# EasyEDA Pro project 搞机小队_v1.1.3.eprj, board 光流
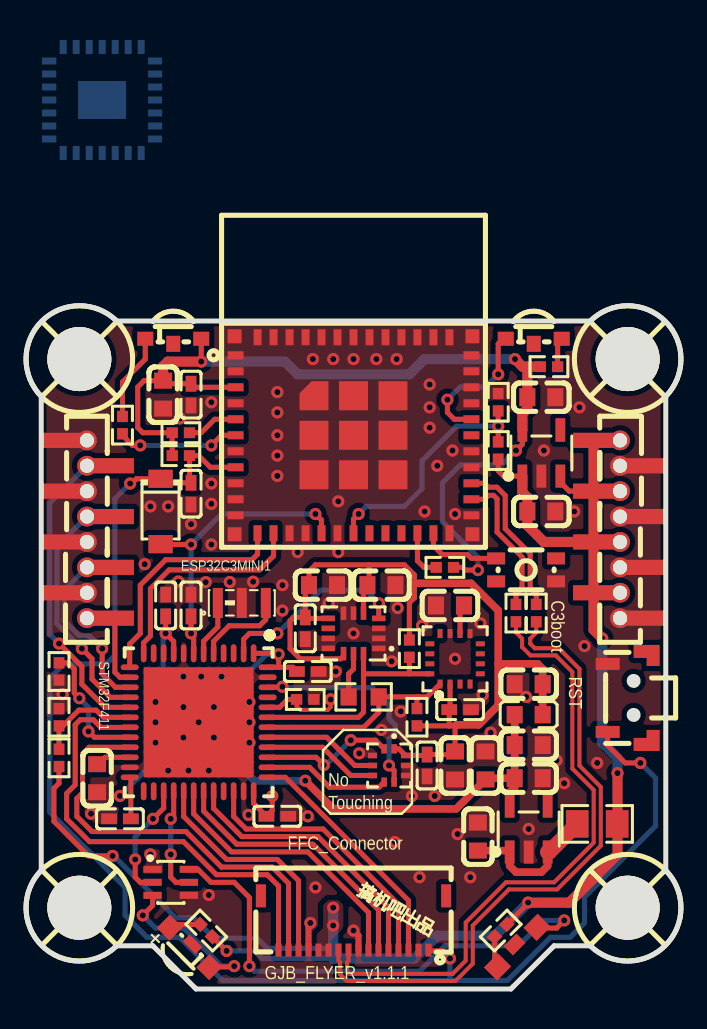
[diagram p4: board, top side]
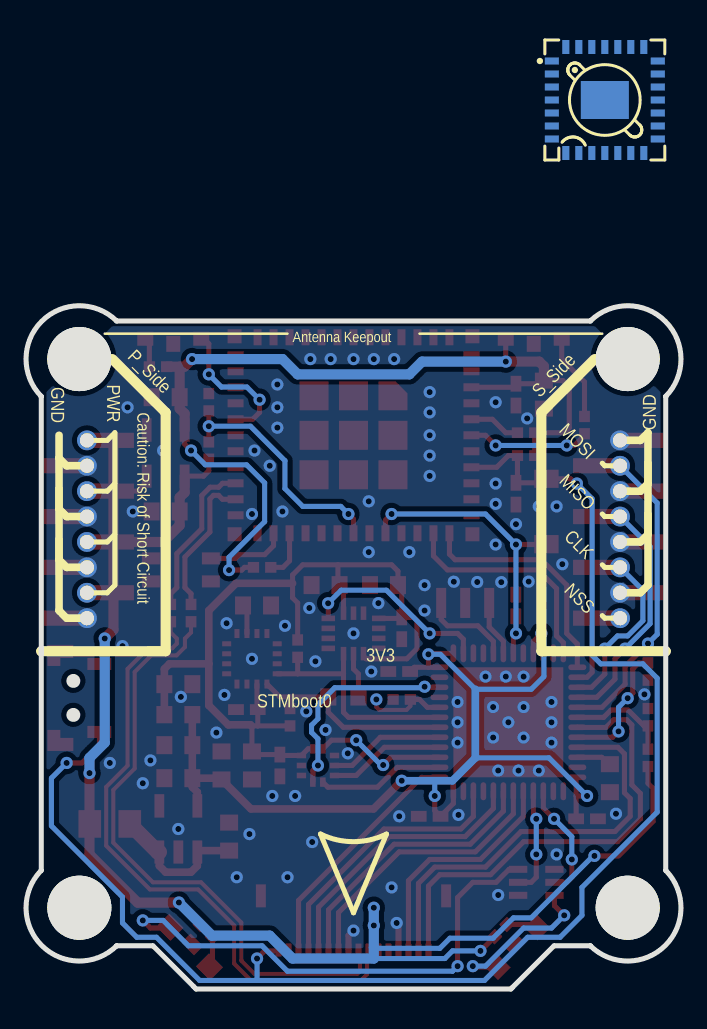
[diagram p5: board, bottom side, seen from below]

Outline 32.77 x 34.16 mm; copper layers: Top Layer, Bottom Layer. Coordinates in mm from the lower left corner of the outline.
Outline path: 0.76,29.64 0.77,29.63 0.77,5.93 0.76,5.92 arc(0.79,2.18) 4.53,2.15 4.54,2.16 6.35,2.16 8.51,0 24.26,0 26.42,2.16 28.24,2.16 28.24,2.15 arc(31.99,2.18) 32.01,5.92 32.01,5.93 32.01,29.63 32.01,29.64 arc(31.99,33.38) 28.24,33.41 28.24,33.4 4.54,33.4 4.53,33.41 arc(0.79,33.38) 0.76,29.64
Stack: Top Layer 0.035mm / Dielectric1 1.51mm FR4 er 4.5 / Bottom Layer 0.035mm

## Design rules (mm)
net $1N52615: DP5
net $1N52617: DP5
net UD3_N: DP4
net UD3_P: DP4
template: 自定义配置
spacing copperThickness1oz (default): track to track 0.102, other pairs 0.152 to 0.3
spacing copperThickness2oz: track to track 0.203, other pairs 0.152 to 0.3
track width copperThickness1oz (default): min 0.127, default 0.254, max 2.54
track width copperThickness2oz: min 0.203, default 0.254, max 2.54
differential pair differentialPair (default): width min 0.127, default 0.254, max 2.54; gap min 0.152, default 0.152
via viaSize (default): diameter min 0.5, default 0.61, max 10; hole min 0.3, default 0.305, max 6.3

## Placement (name value [footprint] x y rotation side)
C3  10uF  [C0603]  25.79 23.88 180 top
C4  1uF  [C0603]  25.79 29.59 180 top
C6  1uF  [C0603]  25.15 10.54 180 top
C7  1uF  [C0603]  22.61 7.62 270 top
C8  10uF  [C0603]  25.15 12.19 180 top
C9  10uF  [C0603]  25.15 15.24 0 top
C27  10uF  [C0603]  3.56 10.54 90 top
C31  10uF  [C0603]  22.99 11.18 270 top
C41  10uF  [C0603]  6.86 29.72 270 top
C51  4.7uF  [C0603]  21.47 11.18 270 top
C52  4.7uF  [C0603]  21.21 19.18 180 top
C55  2.2uF  [C0603]  14.86 20.19 180 top
C56  10nF  [C0603]  17.78 20.19 180 top
C65  100nF  [C0402]  4.7 8.51 0 top
C66  100nF  [C0402]  12.58 8.64 180 top
C67  100nF  [C0402]  14.1 15.88 180 top
C68  100nF  [C0402]  6.99 19.18 270 top
C69  100nF  [C0402]  8.26 19.18 270 top
C70  100nF  [C0402]  13.97 18.03 90 top
C71  100nF  [C0402]  21.72 13.97 180 top
C72  100nF  [C0402]  20.07 11.18 90 top
C73  100nF  [C0402]  8.26 24.77 90 top
C74  100nF  [C0402]  8.26 29.72 270 top
D7  B0520W  [SOD-123_L2.7-W1.6-LS3.7-RD]  6.74 23.88 270 top
FPC2  AFC05-S16FIA-00  [FPC-SMD_16P-P0.50_AFC05-S16FIA-00]  16.39 3.3 180 top
L1  1uH  [L0603]  25.15 13.72 0 top
LED2  XL-3210SURC  [LED-SMD_L3.2-W1.5_1204-1.5T_RED]  24.52 2.16 225 top
LED3  XL-3210UWC  [LED-SMD_3P-L3.2-W1.5-RD_ORANGE]  7.37 32.38 0 top
LED4  XL-3210UWC  [LED-SMD_3P-L3.2-W1.5-RD_ORANGE]  25.4 32.38 0 top
NOREF  -  [Pad_e1244]  3.05 23.62 0 top
NOREF#2  -  [Pad_e1266]  29.72 23.62 0 top
NOREF#3  -  [Pad_e1245]  3.05 22.35 0 top
NOREF#4  -  [Pad_e1268]  29.72 21.08 0 top
NOREF#5  -  [Pad_e1269]  29.72 19.81 0 top
NOREF#6  -  [Pad_e1246]  3.05 21.08 0 top
NOREF#7  -  [Pad_e1267]  29.72 22.35 0 top
NOREF#8  -  [Pad_e1242]  3.05 26.16 0 top
NOREF#9  -  [Pad_e1270]  29.72 18.54 0 top
NOREF#10  -  [Pad_e1264]  29.72 26.16 0 top
NOREF#11  -  [Pad_e1247]  3.05 19.81 0 top
NOREF#12  -  [Pad_e1243]  3.05 24.89 0 top
NOREF#13  -  [Pad_e1241]  3.05 27.43 0 top
NOREF#14  -  [Pad_e1248]  3.05 18.54 0 top
NOREF#15  -  [Pad_e1265]  29.72 24.89 0 top
NOREF#16  -  [Pad_e1263]  29.72 27.43 0 top
Q7  BSS138PS  [SOT-363_L2.1-W1.3-P0.65-LS2.3-BL]  7.24 5.33 270 top
R2  0Ω  [R0805]  28.58 8.25 180 top
R51  0Ω  [R0402]  24.52 18.8 90 top
R52  0Ω  [R0402]  25.53 18.8 90 top
R53  10kΩ  [R0402]  7.75 27.81 0 top
R54  10kΩ  [R0402]  20.96 21.08 180 top
R55  10kΩ  [R0402]  7.75 26.67 180 top
R56  10kΩ  [R0402]  1.66 15.88 270 top
R57  10kΩ  [R0402]  13.97 14.48 180 top
R71  10kΩ  [R0402]  1.66 11.56 270 top
R72  10kΩ  [R0402]  1.66 13.59 270 top
R73  10kΩ  [R0402]  23.63 26.92 270 top
R74  10kΩ  [R0402]  23.63 29.34 270 top
R80  4.7kΩ  [R0402]  19.18 17.02 270 top
R81  4.7kΩ  [R0402]  19.56 13.59 90 top
R100  10kΩ  [R0402]  9.02 2.92 315 top
R101  10kΩ  [R0402]  23.75 2.92 45 top
R102  10kΩ  [R0402]  4.83 28.19 90 top
R103  10kΩ  [R0402]  26.17 31.11 180 top
R104  0Ω  [R0603]  16.9 14.6 0 top
SCREW5  -  [M3螺丝]  2.67 31.5 0 top
SCREW6  -  [M3螺丝]  2.67 4.06 0 top
SCREW7  -  [M3螺丝]  30.1 31.5 0 top
SCREW8  -  [M3螺丝]  30.1 4.06 0 top
SW3  TS24CA  [SW-SMD_2P-TS24CA]  30.08 14.55 270 top
SW4  1TS028A-1800-0600-CT  [SW-SMD_4P-L2.8-W1.9-P1.20-LS3.0_1TS028A]  25.02 20.95 0 top
U2  XC6204B302MR  [SOT-23-5_L3.0-W1.7-P0.95-LS2.8-BL]  25.79 26.8 0 top
U3  XC6204B302MR  [SOT-23-5_L3.0-W1.7-P0.95-LS2.8-BL]  25.15 8 0 top
U9  STM32F411CEU6  [UFQFPN-48_L7.0-W7.0-P0.50-BL-EP]  8.64 13.33 180 top
U10  2.4GHz  [WIFIM-SMD_ESP32-C3-MINI-1]  16.39 27.69 0 top
U15  LPS22HBTR  [HLGA-10L_LPS22HBTR]  18.17 11.18 270 top
U16  QMC5883P  [LGA-16_L3.0-W3.0-P0.50-BL_SQ]  21.47 16.51 0 top
U17  ICM-42688-P  [LGA-14_L3.0-W2.5-P0.50-TL]  16.39 17.78 180 top
U20  XL-3210UGC  [LED-SMD_3P-L3.2-W1.5-RD_GREEN]  8.26 2.16 135 top
U21  IPCP127F08PB08S  [HDR-SMD_IPCP127F08PB08S]  3.05 22.99 270 top
U22  IPCP127F08PB08S  [HDR-SMD_IPCP127F08PB08S]  29.72 22.99 90 top
U23  PMW3901MB-TXQT  [COB-28_L6.0-W6.0-P0.65-TL-EP]  3.81 44.45 180 bottom
X2  8MHz  [OSC-SMD_3P-L3.2-W1.3-P1.20]  10.8 19.3 0 top

## Footprints (pads in the part's own frame, mm; a bottom-side part is the same pattern mirrored in y, then rotated)
C0402
  rect 0.79x0.54 smd: 1(-0.545,0) 2(0.545,0)
C0603
  rect 0.8x0.9 smd: 1(-0.7,0) 2(0.7,0)
COB-28_L6.0-W6.0-P0.65-TL-EP
  rect 0.7x0.35 smd: 1(-2.65,1.95) 2(-2.65,1.3) 3(-2.65,0.65) 4(-2.65,0) 5(-2.65,-0.65) 6(-2.65,-1.3) 7(-2.65,-1.95) 15(2.65,-1.95) 16(2.65,-1.3) 17(2.65,-0.65) 18(2.65,0) 19(2.65,0.65) 20(2.65,1.3) 21(2.65,1.95)
  rect 0.35x0.7 smd: 8(-1.95,-2.65) 9(-1.3,-2.65) 10(-0.65,-2.65) 11(0,-2.65) 12(0.65,-2.65) 13(1.3,-2.65) 14(1.95,-2.65) 22(1.95,2.65) 23(1.3,2.65) 24(0.65,2.65) 25(0,2.65) 26(-0.65,2.65) 27(-1.3,2.65) 28(-1.95,2.65)
  rect 2.4x1.9 smd: 29(0,0)
FPC-SMD_16P-P0.50_AFC05-S16FIA-00
  rect 0.3x0.65 smd: 1(-3.75,1.355) 2(-3.25,1.355) 3(-2.75,1.355) 4(-2.25,1.355) 5(-1.75,1.355) 6(-1.25,1.355) 7(-0.75,1.355) 8(-0.25,1.355) 9(0.25,1.355) 10(0.75,1.355) 11(1.25,1.355) 12(1.75,1.355) 13(2.25,1.355) 14(2.75,1.355) 15(3.25,1.355) 16(3.75,1.355)
  rect 0.5x1.15 smd: 17(4.635,-1.355) 18(-4.635,-1.355)
HDR-SMD_IPCP127F08PB08S
  rect 0.76x2.05 smd: 1(-4.445,-1.325) 2(-3.175,1.325) 3(-1.905,-1.325) 4(-0.635,1.325) 5(0.635,-1.325) 6(1.905,1.325) 7(3.175,-1.325) 8(4.445,1.325)
HLGA-10L_LPS22HBTR
  rect 0.465x0.28 smd: 1(-0.833,0.255) 2(-0.833,-0.245) 6(0.833,-0.245) 7(0.833,0.255)
  rect 0.28x0.465 smd: 3(-0.5,-0.828) 4(0,-0.828) 5(0.5,-0.828) 8(0.5,0.828) 9(0,0.828) 10(-0.5,0.828)
L0603
  rect 0.8x0.864 smd: 1(-0.7,0) 2(0.7,0)
LED-SMD_3P-L3.2-W1.5-RD_GREEN
  rect 0.9x0.93 smd: 1(-1.4,0.11) 2(1.4,0.11)
  rect 0.9x0.49 smd: 3(0,-0.11)
LED-SMD_3P-L3.2-W1.5-RD_ORANGE
  rect 0.8x0.7 smd: 1(-1.4,0.127) 2(1.4,0.127)
  rect 0.7x0.8 smd: 3(0,-0.127)
LED-SMD_L3.2-W1.5_1204-1.5T_RED
  rect 1x0.93 smd: 1(-1.4,0.095) 2(1.4,0.095)
  rect 0.9x0.65 smd: 3(0,-0.095)
LGA-14_L3.0-W2.5-P0.50-TL
  rect 0.675x0.28 smd: 1(-1.262,0.75) 2(-1.262,0.25) 3(-1.262,-0.25) 4(-1.262,-0.75) 8(1.262,-0.75) 9(1.262,-0.25) 10(1.262,0.25) 11(1.262,0.75)
  rect 0.28x0.675 smd: 5(-0.5,-1.012) 6(0,-1.012) 7(0.5,-1.012) 12(0.5,1.012) 13(0,1.012) 14(-0.5,1.012)
LGA-16_L3.0-W3.0-P0.50-BL_SQ
  rect 0.25x0.45 smd: 1(-0.75,-1.263) 2(-0.25,-1.263) 3(0.25,-1.263) 4(0.75,-1.263) 9(0.75,1.263) 10(0.25,1.263) 11(-0.25,1.263) 12(-0.75,1.263)
  rect 0.45x0.25 smd: 5(1.263,-0.75) 6(1.263,-0.25) 7(1.263,0.25) 8(1.263,0.75) 13(-1.263,0.75) 14(-1.263,0.25) 15(-1.263,-0.25) 16(-1.263,-0.75)
M3螺丝
  round 3.2 hole 3.2: 1(0,0)
OSC-SMD_3P-L3.2-W1.3-P1.20
  rect 0.5x1.5 smd: 1(-1.2,0) 2(0,0) 3(1.2,0)
Pad_e1241
  round 0.991 hole 0.711: 1(0,0)
Pad_e1242
  round 0.991 hole 0.711: 2(0,0)
Pad_e1243
  round 0.991 hole 0.711: 3(0,0)
Pad_e1244
  round 0.991 hole 0.711: 4(0,0)
Pad_e1245
  round 0.991 hole 0.711: 5(0,0)
Pad_e1246
  round 0.991 hole 0.711: 6(0,0)
Pad_e1247
  round 0.991 hole 0.711: 7(0,0)
Pad_e1248
  round 0.991 hole 0.711: 8(0,0)
Pad_e1263
  round 0.991 hole 0.711: 1(0,0)
Pad_e1264
  round 0.991 hole 0.711: 2(0,0)
Pad_e1265
  round 0.991 hole 0.711: 3(0,0)
Pad_e1266
  round 0.991 hole 0.711: 4(0,0)
Pad_e1267
  round 0.991 hole 0.711: 5(0,0)
Pad_e1268
  round 0.991 hole 0.711: 6(0,0)
Pad_e1269
  round 0.991 hole 0.711: 7(0,0)
Pad_e1270
  round 0.991 hole 0.711: 8(0,0)
R0402
  rect 0.566x0.54 smd: 1(-0.433,0) 2(0.433,0)
R0603
  rect 0.806x0.864 smd: 1(-0.753,0) 2(0.753,0)
R0805
  rect 1.133x1.377 smd: 1(-1,0) 2(1,0)
SOD-123_L2.7-W1.6-LS3.7-RD
  rect 0.91x1.22 smd: 1(-1.635,0) 2(1.635,0)
SOT-23-5_L3.0-W1.7-P0.95-LS2.8-BL
  rect 0.49x1.157 smd: 1(-0.95,-1.153) 2(0,-1.153) 3(0.95,-1.153)
  rect 0.49x1.175 smd: 4(0.95,1.153) 5(-0.95,1.153)
SOT-363_L2.1-W1.3-P0.65-LS2.3-BL
  rect 0.35x0.916 smd: 1(-0.65,-0.908) 2(0,-0.908) 3(0.65,-0.908) 4(0.65,0.908) 5(0,0.908) 6(-0.65,0.908)
SW-SMD_2P-TS24CA
  rect 0.6x1.2 smd: 1(-1.7,-0.975) 2(1.7,-0.975)
  custom 1.05x1.3 smd: 3(2.125,0.975) 4(-2.125,0.975)
SW-SMD_4P-L2.8-W1.9-P1.20-LS3.0_1TS028A
  rect 0.9x0.6 smd: 1(-1.5,0.575) 2(-1.5,-0.575) 3(1.5,0.575) 4(1.5,-0.575)
UFQFPN-48_L7.0-W7.0-P0.50-BL-EP
  oval 0.28x0.9 smd: 1(-2.751,-3.45) 2(-2.251,-3.45) 3(-1.75,-3.45) 4(-1.25,-3.45) 5(-0.749,-3.45) 6(-0.249,-3.45) 7(0.249,-3.45) 8(0.75,-3.45) 9(1.25,-3.45) 10(1.75,-3.45) 11(2.251,-3.45) 12(2.751,-3.45) 25(2.751,3.449) 26(2.251,3.449) 27(1.75,3.449) 28(1.25,3.449) 29(0.75,3.449) 30(0.249,3.449) 31(-0.249,3.449) 32(-0.749,3.449) 33(-1.25,3.449) 34(-1.75,3.449) 35(-2.251,3.449) 36(-2.751,3.449)
  oval 0.9x0.28 smd: 13(3.45,-2.751) 14(3.45,-2.251) 15(3.45,-1.75) 16(3.45,-1.25) 17(3.45,-0.75) 18(3.45,-0.249) 19(3.45,0.249) 20(3.45,0.749) 21(3.45,1.25) 22(3.45,1.75) 23(3.45,2.251) 24(3.45,2.751) 37(-3.449,2.751) 38(-3.449,2.251) 39(-3.449,1.75) 40(-3.449,1.25) 41(-3.449,0.749) 42(-3.449,0.249) 43(-3.449,-0.249) 44(-3.449,-0.75) 45(-3.449,-1.25) 46(-3.449,-1.75) 47(-3.449,-2.251) 48(-3.449,-2.751)
  rect 5.5x5.5 smd: 49(0,0)
WIFIM-SMD_ESP32-C3-MINI-1
  rect 0.8x0.4 smd: 1(-5.9,4) 2(-5.9,3.2) 3(-5.9,2.4) 4(-5.9,1.6) 5(-5.9,0.8) 6(-5.9,0) 7(-5.9,-0.8) 8(-5.9,-1.6) 9(-5.9,-2.4) 10(-5.9,-3.2) 11(-5.9,-4) 25(5.9,-4) 26(5.9,-3.2) 27(5.9,-2.4) 28(5.9,-1.6) 29(5.9,-0.8) 30(5.9,0) 31(5.9,0.8) 32(5.9,1.6) 33(5.9,2.4) 34(5.9,3.2) 35(5.9,4)
  rect 0.4x0.8 smd: 12(-4.8,-4.9) 13(-4,-4.9) 14(-3.2,-4.9) 15(-2.4,-4.9) 16(-1.6,-4.9) 17(-0.8,-4.9) 18(0,-4.9) 19(0.8,-4.9) 20(1.6,-4.9) 21(2.4,-4.9) 22(3.2,-4.9) 23(4,-4.9) 24(4.8,-4.9) 36(4.8,4.9) 37(4,4.9) 38(3.2,4.9) 39(2.4,4.9) 40(1.6,4.9) 41(0.8,4.9) 42(0,4.9) 43(-0.8,4.9) 44(-1.6,4.9) 45(-2.4,4.9) 46(-3.2,4.9) 47(-4,4.9) 48(-4.8,4.9)
  custom 1.45x1.45 smd: 49(-1.975,1.975)
  rect 1.45x1.45 smd: 49(-1.975,0) 49(-1.975,-1.975) 49(0,1.975) 49(0,0) 49(0,-1.975) 49(1.975,1.975) 49(1.975,0) 49(1.975,-1.975)
  rect 0.7x0.7 smd: 50(5.95,4.95) 51(5.95,-4.95) 52(-5.95,-4.95) 53(-5.95,4.95)

## Nets
3V3_D: C6.2 C8.2 C31.2 C65.2 C66.2 C67.2 C68.2 L1.1 U3.5 U9.1 U9.9 U9.24 U9.36 U9.48
3V3_IMU: C9.2 C51.1 C55.2 C56.2 C70.2 C71.2 C72.2 L1.2 R80.1 R81.1 U15.1 U15.10 U16.2 U17.5 U17.8 U17.12
3V3_RF: C4.2 C41.1 C74.1 LED3.2 R53.1 R54.1 R55.2 R103.2 U2.5 U10.3
GND: C3.1 C4.1 C6.1 C7.1 C8.1 C9.1 C27.1 C31.1 C41.2 C51.2 C52.2 C55.1 C56.1 C65.1 C66.1 C67.1 C68.1 C69.1 C70.1 C71.1 C72.1 C73.1 C74.2 FPC2.2 FPC2.8 FPC2.13 NOREF#2.4 NOREF#3.5 NOREF#4.6 NOREF#9.8 NOREF#10.2 NOREF#11.7 NOREF#12.3 NOREF#13.1 Q7.1 Q7.4 R56.2 R57.1 R72.1 R74.1 SW3.1 SW4.4 U2.2 U3.2 U9.8 U9.23 U9.35 U9.47 U9.49 U10.1 U10.2 U10.4 U10.7 U10.9 U10.10 U10.11 U10.14 U10.15 U10.17 U10.24 U10.25 U10.28 U10.29 U10.32 U10.33 U10.34 U10.35 U10.36 U10.37 U10.38 U10.39 U10.40 U10.41 U10.42 U10.43 U10.44 U10.45 U10.46 U10.47 U10.48 U10.49 U10.50 U10.51 U10.52 U10.53 U15.3 U15.8 U15.9 U16.9 U16.11 U17.1 U17.2 U17.3 U17.6 U17.7 U17.10 U17.11 U21.1 U21.3 U21.5 U21.7 U22.1 U22.3 U22.5 U22.7 U23.1 U23.21 U23.29 X2.2
BARO_INT: U9.46 U15.7
BOOT_IO9: SW4.1 U10.23
ESP_V_SENSE: R73.1 R74.2 U10.18
IMU_INT1: U9.2 U17.4
LED_G: Q7.3 U20.1
LED_G#: Q7.5 U9.28
LED_R: LED2.1 Q7.6
LED_R#: Q7.2 U9.27
LED_WL: R102.1 U10.6
LED_WR: LED4.1 U10.31
MOTOR1: FPC2.14 U9.29
MOTOR2: FPC2.15 U9.21
MOTOR3: FPC2.16 U9.19
MOTOR4: FPC2.5 U9.32
NRST: C73.2 D7.1 FPC2.1 R55.1 SW3.2 U10.8
POWER: C3.2 FPC2.11 FPC2.12 NOREF#5.7 NOREF#7.5 NOREF#15.3 NOREF#16.1 R2.1 R71.2 R73.2 R100.2 R101.2 U2.1 U2.3 U22.2 U22.4 U22.6 U22.8
STM_BOOT0: R57.2 U9.44
STM_NRST: C69.2 D7.2 U9.7 U10.16
STM_RXD1: FPC2.6 U9.31
STM_RXD2: U9.13 U10.12
STM_SPI_CLK1: NOREF#6.6 U9.15 U21.6
STM_SPI_CLK3: U9.39 U15.2
STM_SPI_MISO1: NOREF.4 U9.16 U21.4
STM_SPI_MISO3: U9.40 U15.5
STM_SPI_MOSI1: NOREF#8.2 U9.17 U21.2
STM_SPI_MOSI3: U9.41 U15.4
STM_SPI_NSS1: NOREF#14.8 U9.14 U21.8
STM_SPI_NSS3: U9.38 U15.6
STM_SWCLK: FPC2.3 U9.37
STM_SWDIO: FPC2.4 U9.34
STM_TXD1: FPC2.7 U9.30
STM_TXD2: U9.12 U10.13
STM_V_SENSE: R71.1 R72.2 U9.18
STMI2C_SCL1: R81.2 R104.2 U9.42 U16.1
STMI2C_SDA1: R80.2 U9.43 U16.16 U17.14
UD3_N: FPC2.9 R51.1
UD3_P: FPC2.10 R52.1
$1N7736: C7.2 R2.2 U3.1 U3.3
$1N7770: C27.2 U9.22
$1N7798: U9.5 X2.3
$1N7799: U9.6 X2.1
$1N7801: R56.1 U9.20
$1N11574: R53.2 U10.5
$1N11654: R54.2 U10.22
$1N15598: C52.1 U16.10
$1N42229: R104.1 U17.13
$1N52615: R51.2 U10.26
$1N52617: R52.2 U10.27
$1N93489: R100.1 U20.2
$1N93528: LED2.2 R101.1
$1N93606: LED4.2 R103.1
$1N93656: LED3.1 R102.2

Pads without a net: FPC2 17 18; LED2 3; LED3 3; LED4 3; SCREW5 1; SCREW6 1; SCREW7 1; SCREW8 1; SW3 3 4; SW4 2 3; U2 4; U3 4; U9 3 4 10 11 25 26 33 45; U10 19 20 21 30; U16 3 4 5 6 7 8 12 13 14 15; U17 9; U20 3; U23 2 3 4 5 6 7 8 9 10 11 12 13 14 15 16 17 18 19 20 22 23 24 25 26 27 28

## Via types
v1: diameter 0.61, hole 0.305, Top Layer to Bottom Layer, 137 vias

## Routing (per net, layer and track width the routed paths; a pad name or vN(x,y) marks a point on that pad's centre or on a via; arc(x,y) is an arc through that point)
3V3_D: length 50.8
  Top Layer w0.254: U9.24 5.25,10.53 5.25,9.65 ; v1(12.32,9.65) 12.32,8.93 C66.2 11.39,9.28 U9.36 ; 5.25,9.65 v1(4.7,9.65) ; 5.25,9.65 C65.2 ; 12.64,16.09 13.35,16.09 C67.2 ; 12.64,16.09 U9.48 ; 12.64,16.09 v1(12.64,16.73) 12.59,16.78 U9.1 ; U9.9 7.39,17.38 v1(6.99,17.78) C68.2
  Top Layer w0.381: v1(13.97,10.41) 15.38,9 21.52,9 C31.2 23.06,10.54 C6.2 ; C6.2 24.45,10.09 24.2,9.84 U3.5 ; C6.2 C8.2 L1.1
  Bottom Layer w0.254: v1(6.99,17.78) 6.86,17.65 6.86,15.62 7.5,14.99 10.29,14.99 12.04,16.73 v1(12.64,16.73) ; 10.29,11.56 6.61,11.56 v1(4.7,9.65) ; v1(12.32,9.65) 12.32,10.41
  Bottom Layer w0.381: v1(13.97,10.41) 11.43,10.41 10.29,11.56 10.29,14.99
3V3_IMU: length 45.6
  Top Layer w0.254: U17.8 14.02,18.53 C70.2 ; U17.5 16.89,20 C56.2 17.17,20.27 17.17,21.21 ; U17.12 15.89,16.64 15.75,16.51 13.72,16.51 13.21,17.02 13.21,18.41 13.38,18.58 C70.2 ; 21.47,13.14 C51.1 21.31,11.72 C72.2 20.03,11.68 U15.10 18.66,12.01 U15.1 ; C70.2 13.97,20 14.16,20.19 14.16,20.89 14.48,21.21 17.17,21.21 ; 21.17,13.16 21.18,13.16 C71.2 21.22,14.01 U16.2 ; 21.17,13.16 R81.1 ; 21.17,13.16 21.49,13.16 ; 17.17,21.21 18.93,21.21 19.44,20.7 19.44,19.56 19.18,19.3 R80.1
  Top Layer w0.381: 23.63,16.26 23.63,14.18 22.65,13.21 21.54,13.21 21.49,13.16 ; 23.63,16.26 23.63,18.92 22.27,20.28 19.44,20.28 ; 23.63,16.26 25.6,16.26 25.85,16 C9.2 L1.2
3V3_RF: length 46.6
  Top Layer w0.254: R55.2 R53.1 5.85,27.81 5.59,28.07 5.59,30.1 5.91,30.42 C41.1 7.02,30.26 C74.1 8.44,30.09 10.23,30.09 ; R54.1 21.84,21.08 21.98,20.95 v1(22.61,20.95) ; v1(8.77,31.37) 8.77,31.37 8.77,32.51 ; v1(24.52,26.92) 24.84,27.24 24.84,27.95
  Top Layer w0.508: R103.2 25.09,31.11 ; 25.09,31.11 C4.2 25.09,29.02 24.84,28.77 24.84,27.95 ; 25.09,31.11 24.85,31.11 v1(24.46,31.5) ; v1(8.77,31.37) 7.09,31.37 6.86,31.14 C41.1
  Bottom Layer w0.254: v1(22.61,20.95) 22.61,21.59 20.83,23.37 20.83,25.3 21.74,26.21 23.8,26.21 v1(24.52,26.92)
  Bottom Layer w0.508: v1(8.77,31.37) 12.96,31.37 13.59,30.73 19.18,30.73 19.94,31.5 v1(24.46,31.5)
GND: length 2.5
  Top Layer w0.305: v1(16.39,2.92) 16.64,2.67 FPC2.8 ; FPC2.13 14.14,3.21 v1(14.23,3.3)
  vias: v1(1.83,14.73) v1(3.26,8.76) v1(5.94,21.24) v1(6.23,24.13) v1(6.23,6.73) v1(6.48,14.35) v1(6.48,13.33) v1(6.48,12.32) v1(7.12,24.13) v1(7.12,10.92) v1(7.7,28.53) v1(7.62,20.37) v1(7.88,15.62) v1(7.88,14.1) v1(7.88,12.57) v1(8.13,10.92) v1(8.26,23.24) v1(8.64,13.33) v1(8.77,15.62) v1(8.99,20.34) v1(9.15,10.92) v1(9.15,4.7) v1(9.28,29.34) v1(9.28,25.27) v1(9.28,24.26) v1(9.28,22.22) v1(9.4,14.1) v1(9.4,12.57) v1(9.78,15.62) v1(10.2,20.35) v1(11.18,14.35) v1(11.18,13.33) v1(11.18,12.32) v1(11.14,8.7) v1(11.37,20.36) v1(12.58,29.84) v1(12.58,28.83) v1(12.58,27.69) v1(12.58,26.67) v1(12.58,25.65) v1(12.83,20.19) v1(12.83,18.92) v1(13.59,21.84) v1(14.1,8.64) v1(14.36,31.5) v1(14.48,5.08) v1(15.14,19.29) v1(15.37,31.5) v1(15.5,15.88) v1(15.63,24.38) v1(15.63,21.84) v1(16.39,31.5) v1(16.39,17.78) v1(16.67,11.78) v1(17.53,31.5) v1(17.78,12.95) v1(18.29,16.38) v1(18.45,7.35) v1(18.55,31.5) v1(18.6,19.05) v1(18.75,13.88) v1(19.31,9.65) v1(19.69,5.59) v1(19.82,18.16) v1(19.94,23.88) v1(20.2,30.23) v1(20.2,29.08) v1(20.2,28.07) v1(20.45,9.65) v1(20.58,26.16) v1(21.34,26.92) v1(21.47,23.75) v1(21.47,16.51) v1(21.59,7.75) v1(22.23,5.59) v1(22.74,18.29) v1(22.85,14.7) v1(23.25,12.82) v1(25.02,14.6) v1(25.15,8) v1(25.91,26.92) v1(26.55,11.43) v1(26.93,10.29) v1(27.43,23.88) v1(27.69,29.08) v1(27.94,17.14) v1(28.58,11.3)
BARO_INT: length 10.7
  Top Layer w0.254: v1(18.17,11.18) 18.42,10.92 U15.7 ; U9.46 12.8,15.08 v1(12.83,15.11)
  Bottom Layer w0.254: v1(18.17,11.18) 18.17,12.51 18.49,12.83 18.49,13.19 18.17,13.51 18.17,14.22 17.33,15.06 12.88,15.06 v1(12.83,15.11)
BOOT_IO9: length 4
  Top Layer w0.254: U10.23 20.39,22.16 20.83,21.72 22.1,21.72 22.29,21.53 SW4.1
ESP_V_SENSE: length 12.2
  Top Layer w0.254: U10.18 16.39,23.49 v1(16.64,23.75) ; R73.1 v1(23.63,28.14) R74.2
  Bottom Layer w0.254: v1(23.63,28.14) 21.54,28.14 19.82,26.42 19.82,25.02 18.93,24.13 17.02,24.13 v1(16.64,23.75)
IMU_INT1: length 9.5
  Top Layer w0.254: U17.4 17.65,19.28 v1(17.66,19.29) ; v1(12.58,17.78) 11.18,17.78 10.89,17.49 U9.2
  Bottom Layer w0.254: v1(12.58,17.78) 14.74,19.94 17,19.94 v1(17.66,19.29)
LED_G: length 8.1
  Top Layer w0.254: 6.34,4.68 6.34,4.17 v1(5.85,3.68) ; 9.18,1.1 10.38,1.1 v1(10.42,1.14)
  Bottom Layer w0.254: v1(10.42,1.14) 9.78,1.14 7.88,3.05 6.48,3.05 v1(5.85,3.68)
LED_G#: length 5.4
  Top Layer w0.254: 8.14,5.33 7.5,5.33 7.24,5.59 v1(7.24,6.73) ; v1(7.24,8.51) 7.39,8.66 U9.28
  Bottom Layer w0.254: v1(7.24,8.51) v1(7.24,6.73)
LED_R: length 25.5
  Top Layer w0.254: 25.58,3.2 25.73,3.05 26.55,3.05 v1(26.93,3.43) ; v1(11.18,1.14) 11.18,4.57 10.42,5.33 9.25,5.33 8.6,5.98 8.14,5.98
  Bottom Layer w0.254: v1(11.18,1.14) 11.43,0.89 19.69,0.89 20.96,2.16 24.64,2.16 25.91,3.43 v1(26.93,3.43)
LED_R#: length 5.9
  Top Layer w0.254: v1(6.35,8.51) 6.89,9.05 U9.27 ; v1(5.47,6.48) 5.47,5.59 5.72,5.33 6.34,5.33
  Bottom Layer w0.254: v1(5.47,6.48) 5.47,7.62 v1(6.35,8.51)
LED_WL: length 6.2
  Top Layer w0.254: v1(9.28,27.18) 9.78,27.69 U10.6 ; R102.1 4.83,27.69 5.34,27.18 v1(5.72,27.18)
  Bottom Layer w0.254: v1(9.28,27.18) v1(5.72,27.18)
LED_WR: length 7.1
  Top Layer w0.254: v1(23.63,30.73) 23.63,32.26 24,32.64 ; 22.29,28.49 21.43,28.49 21.09,28.83 v1(21.09,29.46)
  Bottom Layer w0.254: v1(23.63,30.73) 22.99,30.1 21.72,30.1 v1(21.09,29.46)
MOTOR1: length 11.8
  Top Layer w0.254: FPC2.14 13.64,5.42 12.58,6.48 10.04,6.48 7.89,8.62 U9.29
MOTOR2: length 21.1
  Top Layer w0.254: U9.21 3.16,12.09 2.83,11.76 2.83,9.81 2.54,9.52 2.54,8.64 3.31,7.87 8.01,7.87 9.78,6.1 12.32,6.1 13.14,5.28 FPC2.15
MOTOR3: length 23.1
  Top Layer w0.254: U9.19 5.19,13.08 3.75,13.08 3.37,13.46 2.72,13.46 2.46,13.21 2.46,10.21 2.04,9.78 2.04,8.51 3.18,7.37 7.88,7.37 9.53,5.71 12.07,5.71 12.64,5.15 FPC2.16
MOTOR4: length 13.8
  Top Layer w0.254: U9.32 9.39,9.03 10.8,7.62 14.61,7.62 18.14,4.09 FPC2.5
NRST: length 73.1
  Top Layer w0.254: v1(21.21,1.52) 20.83,1.91 20.18,1.91 FPC2.1 ; SW3.2 29.1,12.18 29.98,11.3 v1(30.74,11.3) ; v1(5.21,25.27) 5.29,25.27 5.53,25.51 6.75,25.51 6.95,25.31 C73.2 ; 10.23,26.09 9.22,26.09 8.64,26.67 R55.1 8.18,25.64 8.3,25.53
  Bottom Layer w0.254: v1(5.21,25.27) 4.45,24.51 4.45,16.69 4.02,16.26 1.91,16.26 1.19,15.54 1.19,8.84 4.96,5.08 4.96,3.68 6.05,2.59 7.67,2.59 9.83,0.43 21.21,0.43 ; 21.21,0.43 24.08,0.43 26.24,2.59 27.23,2.59 27.94,3.3 27.94,4.6 31.5,8.16 31.5,10.54 v1(30.74,11.3) ; 21.21,0.43 v1(21.21,1.52)
POWER: length 77.9
  Top Layer w0.254: R73.2 23.63,25.91 23.89,25.64 24.84,25.64 ; 9.33,2.61 v1(10.04,1.91) ; v1(4.33,6.66) 3.13,6.66 1.4,8.38 1.4,10.03 1.66,10.29 R71.2 ; U22.6 27.18,24.89 26.74,25.34 U2.3 ; v1(25.12,4.32) 25.12,4.29 24.06,3.23
  Top Layer w0.508: U22.4 U22.2 28.4,17.96 v1(28.83,17.53) ; U22.4 U22.6 U22.8 ; U22.4 25.91,22.35 25.09,23.18 C3.2 25.09,24.58 24.84,24.83 24.84,25.64 ; v1(29.6,10.8) 29.6,6.73 27.18,4.32 25.13,4.32 v1(25.12,4.32)
  Bottom Layer w0.254: 15.37,1.52 11.82,1.52 11.43,1.91 v1(10.04,1.91) ; v1(4.33,6.66) 4.4,6.66 7.5,3.56 8.39,3.56 9.4,2.54 11.56,2.54 12.07,2.03 15.33,2.03 15.37,2.08
  Bottom Layer w0.508: v1(28.83,17.53) 28.83,12.32 29.6,11.56 v1(29.6,10.8) ; v1(25.12,4.32) 23.47,2.67 20.58,2.67 19.44,1.52 15.37,1.52 v1(15.37,3.17) v1(15.37,4.06)
STM_BOOT0: length 4.2
  Top Layer w0.203: v1(15.24,14.48) 15.24,14.1 15.1,13.95 13.74,13.95 13.54,14.15 R57.2
  Top Layer w0.254: U9.44 12.69,14.08 13.09,14.48 R57.2
STM_NRST: length 15.9
  Top Layer w0.254: 6.61,22.24 6.62,22.22 v1(8.26,22.22) ; C69.2 v1(8.26,17.78) 8.39,17.65 U9.7 ; v1(14.48,23.75) 14.79,23.44 14.79,22.79
  Bottom Layer w0.254: v1(14.48,23.75) 9.78,23.75 v1(8.26,22.22) v1(8.26,17.78)
STM_RXD1: length 13.8
  Top Layer w0.254: 17.66,1.97 FPC2.6 17.64,3.96 14.36,7.24 10.55,7.24 8.89,8.89 U9.31
STM_RXD2: length 11.9
  Top Layer w0.254: U10.12 11.59,21.74 11.31,21.46 6.99,21.46 5.72,20.19 5.72,17.78 5.19,17.25 U9.13
STM_SPI_CLK1: length 8.5
  Top Layer w0.254: v1(3.81,17.02) 3.81,15.75 4.48,15.08 U9.15
  Bottom Layer w0.254: NOREF#6.6 1.91,19.94 1.91,18.41 2.67,17.65 3.18,17.65 v1(3.81,17.02)
STM_SPI_CLK3: length 6.7
  Top Layer w0.254: v1(14.9,11.2) 14.52,11.58 U9.39 ; v1(16.25,12.44) 17.49,12.44 U15.2
  Bottom Layer w0.254: v1(16.25,12.44) 15.01,11.2 v1(14.9,11.2)
STM_SPI_MISO1: length 11.7
  Top Layer w0.254: U9.16 4.22,14.58 3.31,15.49 3.31,16.51 v1(2.8,17.02)
  Bottom Layer w0.254: v1(2.8,17.02) 1.55,18.27 1.55,22.12 NOREF.4
STM_SPI_MISO3: length 5.8
  Top Layer w0.254: U9.40 14.84,12.09 16.25,10.68 U15.5
STM_SPI_MOSI1: length 15.2
  Top Layer w0.254: v1(1.66,17.27) 2.8,16.13 2.8,15.24 3.95,14.08 U9.17
  Bottom Layer w0.254: NOREF#8.2 1.19,24.3 1.19,17.73 v1(1.66,17.27)
STM_SPI_MOSI3: length 5.8
  Top Layer w0.254: U15.4 16.45,11.18 15.05,12.59 U9.41
STM_SPI_NSS1: length 3.6
  Top Layer w0.254: U21.8 4.45,18.47 4.45,15.84 4.7,15.59 U9.14
STM_SPI_NSS3: length 6.3
  Top Layer w0.254: U9.38 14.19,11.08 15.19,10.09 17.67,10.09 U15.6
STM_SWCLK: length 12.1
  Top Layer w0.254: FPC2.3 19.14,4.43 12.98,10.58 U9.37
STM_SWDIO: length 13.6
  Top Layer w0.254: U9.34 10.39,8.63 11.02,8 14.86,8 18.64,4.23 FPC2.4
STM_TXD1: length 13.8
  Top Layer w0.254: FPC2.7 17.14,3.82 14.1,6.86 10.29,6.86 8.39,8.76 U9.30
STM_TXD2: length 11.3
  Top Layer w0.254: U9.12 5.89,17.31 6.23,17.65 6.23,20.02 7.16,20.95 11.69,20.95 12.39,21.65 U10.13
STM_V_SENSE: length 5.2
  Top Layer w0.254: U9.18 3.87,13.58 3.51,13.94 2.65,13.94 1.86,13.16 R72.2 1.66,11.99
STMI2C_SCL1: length 10.6
  Top Layer w0.254: U9.42 16.9,13.09 17.65,13.83 R104.2 19.59,14.6 ; 19.59,14.6 20.08,14.6 U16.1 ; 19.59,14.6 19.56,14.57 19.56,14.02
STMI2C_SDA1: length 12
  Top Layer w0.254: U16.16 19.18,15.76 ; 19.18,15.76 R80.2 ; 19.18,15.76 16.91,15.76 16.89,15.78 ; 16.89,15.78 U17.14 ; 16.89,15.78 16.89,13.83 16.64,13.58 U9.43
UD3_N: length 30.7
  Top Layer w0.203: FPC2.9 16.14,1.42 16.07,1.35 16.07,0.89 16.2,0.76 21.34,0.76 22,1.42 22,3.32 24.01,5.33 26.42,5.33 28.4,7.32 28.4,9.95 27.33,11.02 27.33,15.85 26.5,16.68 25.24,16.68 24.82,17.1 24.82,17.52 24.52,17.83 R51.1
UD3_P: length 31.8
  Top Layer w0.203: R52.1 25.53,17.83 25.23,17.52 25.23,17.27 25.46,17.04 26.66,17.04 27.69,16 27.69,11.17 28.76,10.1 28.76,7.16 26.57,4.98 24.16,4.98 22.36,3.17 22.36,1.27 21.49,0.4 16.05,0.4 15.71,0.74 15.71,1.35 15.64,1.42 FPC2.10
$1N7736: length 7.2
  Top Layer w0.381: 22.61,6.92 24.13,6.92 U3.1 24.2,6.16 24.52,5.84 25.79,5.84 26.1,6.16 U3.3
  Top Layer w0.762: U3.3 26.17,6.85 R2.2
$1N7770: length 1.8
  Top Layer w0.254: C27.2 3.63,11.24 3.97,11.58 U9.22
$1N7798: length 4.5
  Top Layer w0.254: X2.3 12,18.47 11.69,18.16 10.16,18.16 9.39,17.39 U9.5
$1N7799: length 2.8
  Top Layer w0.254: U9.6 8.89,17.39 9.6,18.1 X2.1
$1N7801: length 6.5
  Top Layer w0.254: U9.20 3.42,12.59 v1(3.13,12.88) ; R56.1 2.11,16.31 2.42,16 2.42,14.8 v1(2.67,14.54)
  Bottom Layer w0.254: v1(2.67,14.54) 3.13,14.08 v1(3.13,12.88)
$1N11574: length 2.3
  Top Layer w0.254: 10.23,28.49 9.44,28.49 8.77,27.81 R53.2
$1N11654: length 2.2
  Top Layer w0.254: U10.22 19.59,21.41 19.91,21.08 20.27,21.08
$1N15598: length 1.5
  Top Layer w0.254: U16.10 21.72,18.98 C52.1
$1N42229: length 2.3
  Top Layer w0.254: R104.1 16.14,15.76 16.39,16 U17.13
$1N52615: length 7.4
  Top Layer w0.254: 22.29,24.49 22.94,24.49 23.14,24.68 23.39,24.68 23.57,24.5 23.57,22.85 24.82,21.6 24.82,20.07 24.52,19.77 R51.2
$1N52617: length 8
  Top Layer w0.254: 22.29,25.29 22.94,25.29 23.14,25.09 23.56,25.09 23.98,24.67 23.98,23.02 25.23,21.77 25.23,20.07 25.53,19.77 R52.2
$1N93489: length 1.6
  Top Layer w0.254: 7.2,3.08 7.35,3.23 R100.1
$1N93528: length 1.6
  Top Layer w0.254: R101.1 23.45,1.25 23.6,1.09
$1N93606: length 1.4
  Top Layer w0.254: 26.6,31.24 26.6,32.31 26.8,32.51
$1N93656: length 4.4
  Top Layer w0.254: 5.97,32.51 5.97,31.49 4.83,30.35 R102.2

## Copper pours and planes (outline as drawn; the poured copper is in the pictures)
GND on Top Layer: 4.58,33.4 0.77,29.59 0.77,5.97 4.58,2.16 6.35,2.16 8.51,0 24.26,0 26.42,2.16 28.2,2.16 32.01,5.97 32.01,29.59 28.2,33.4
GND on Bottom Layer: 4.58,33.4 0.77,29.59 0.77,5.97 4.58,2.16 6.35,2.16 8.51,0 24.26,0 26.42,2.16 28.2,2.16 32.01,5.97 32.01,29.59 28.2,33.4
POWER on Top Layer: 14.48,1.63 15.3,1.63 15.3,2.46 15.88,3.05 15.88,4.19 15.63,4.44 15.12,4.44 14.86,4.19 14.86,3.05 14.48,2.67

## Text on the board
Bottom Silkscreen Layer: Antenna Keepout | Caution: Risk of Short Circuit | 3V3 | STMboot0 | CLK | NSS | MOSI | MISO | PWR | GND | S_Side | P_Side
Top Silkscreen Layer: ESP32C3MINI1 | STM32F411 | GJB_FLYER_v1.1.1 | FFC_Connector | No / Touching | C3boot | RST | 搞机吧出品
